# EAGLE design proj_pcb (EAGLE 7.5.0)
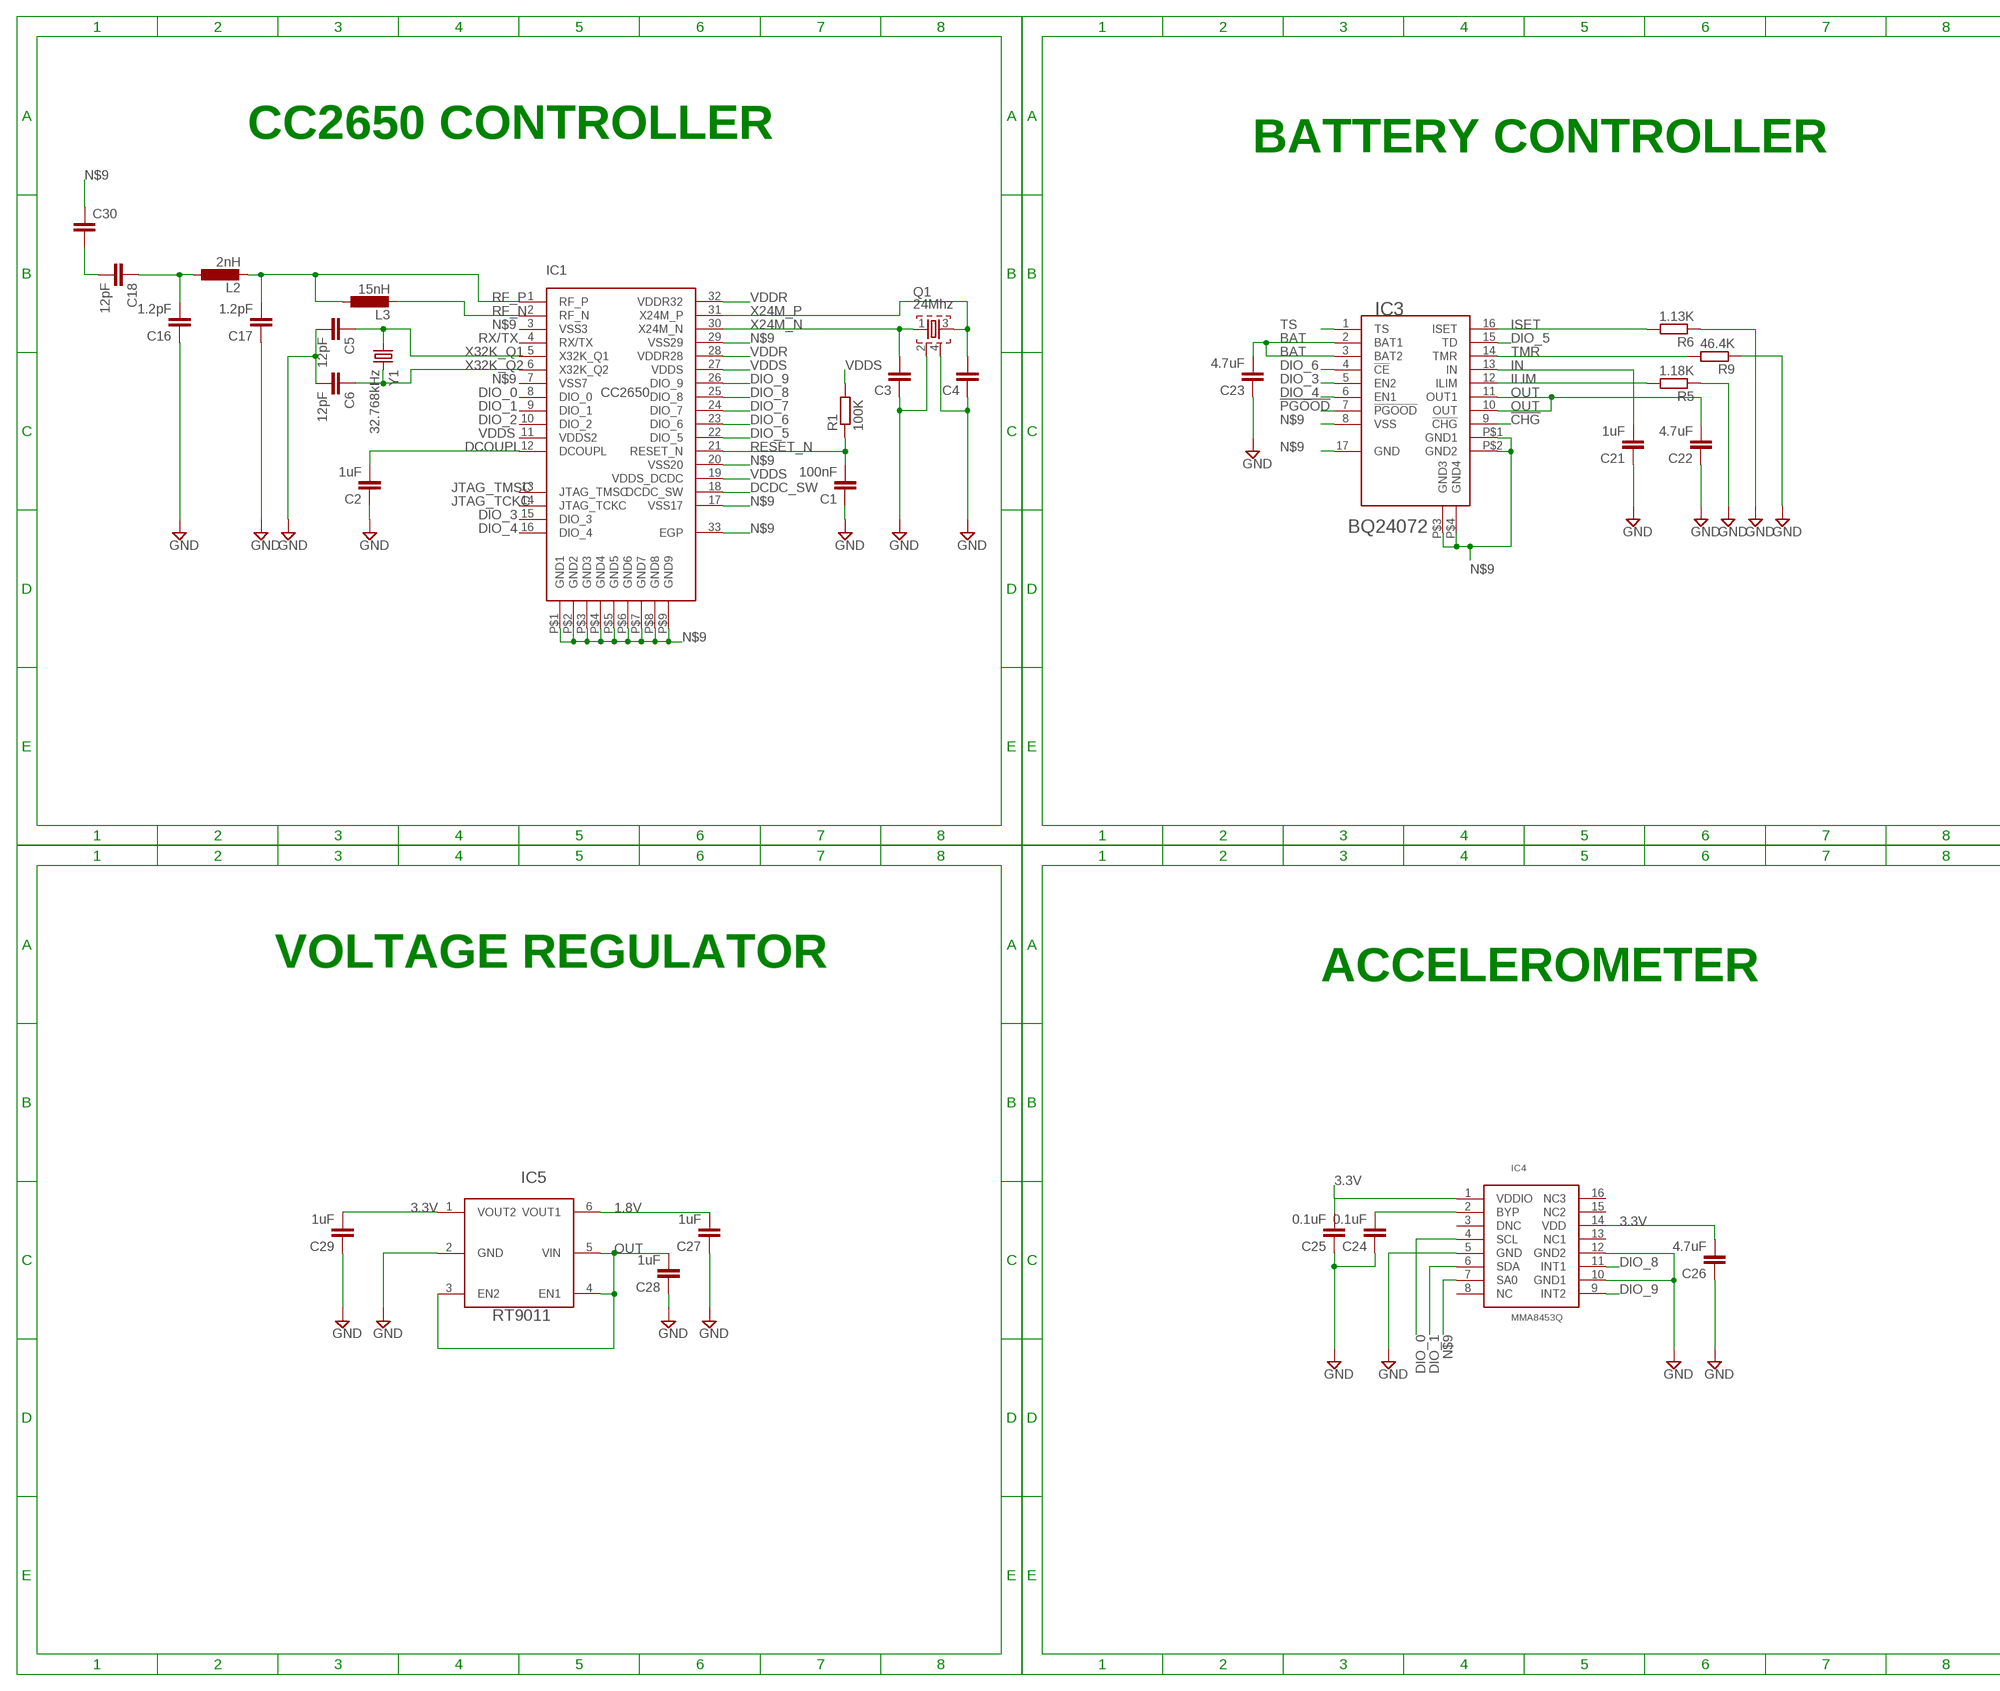
[diagram p0: schematic, sheet 1, part 1 of 2]
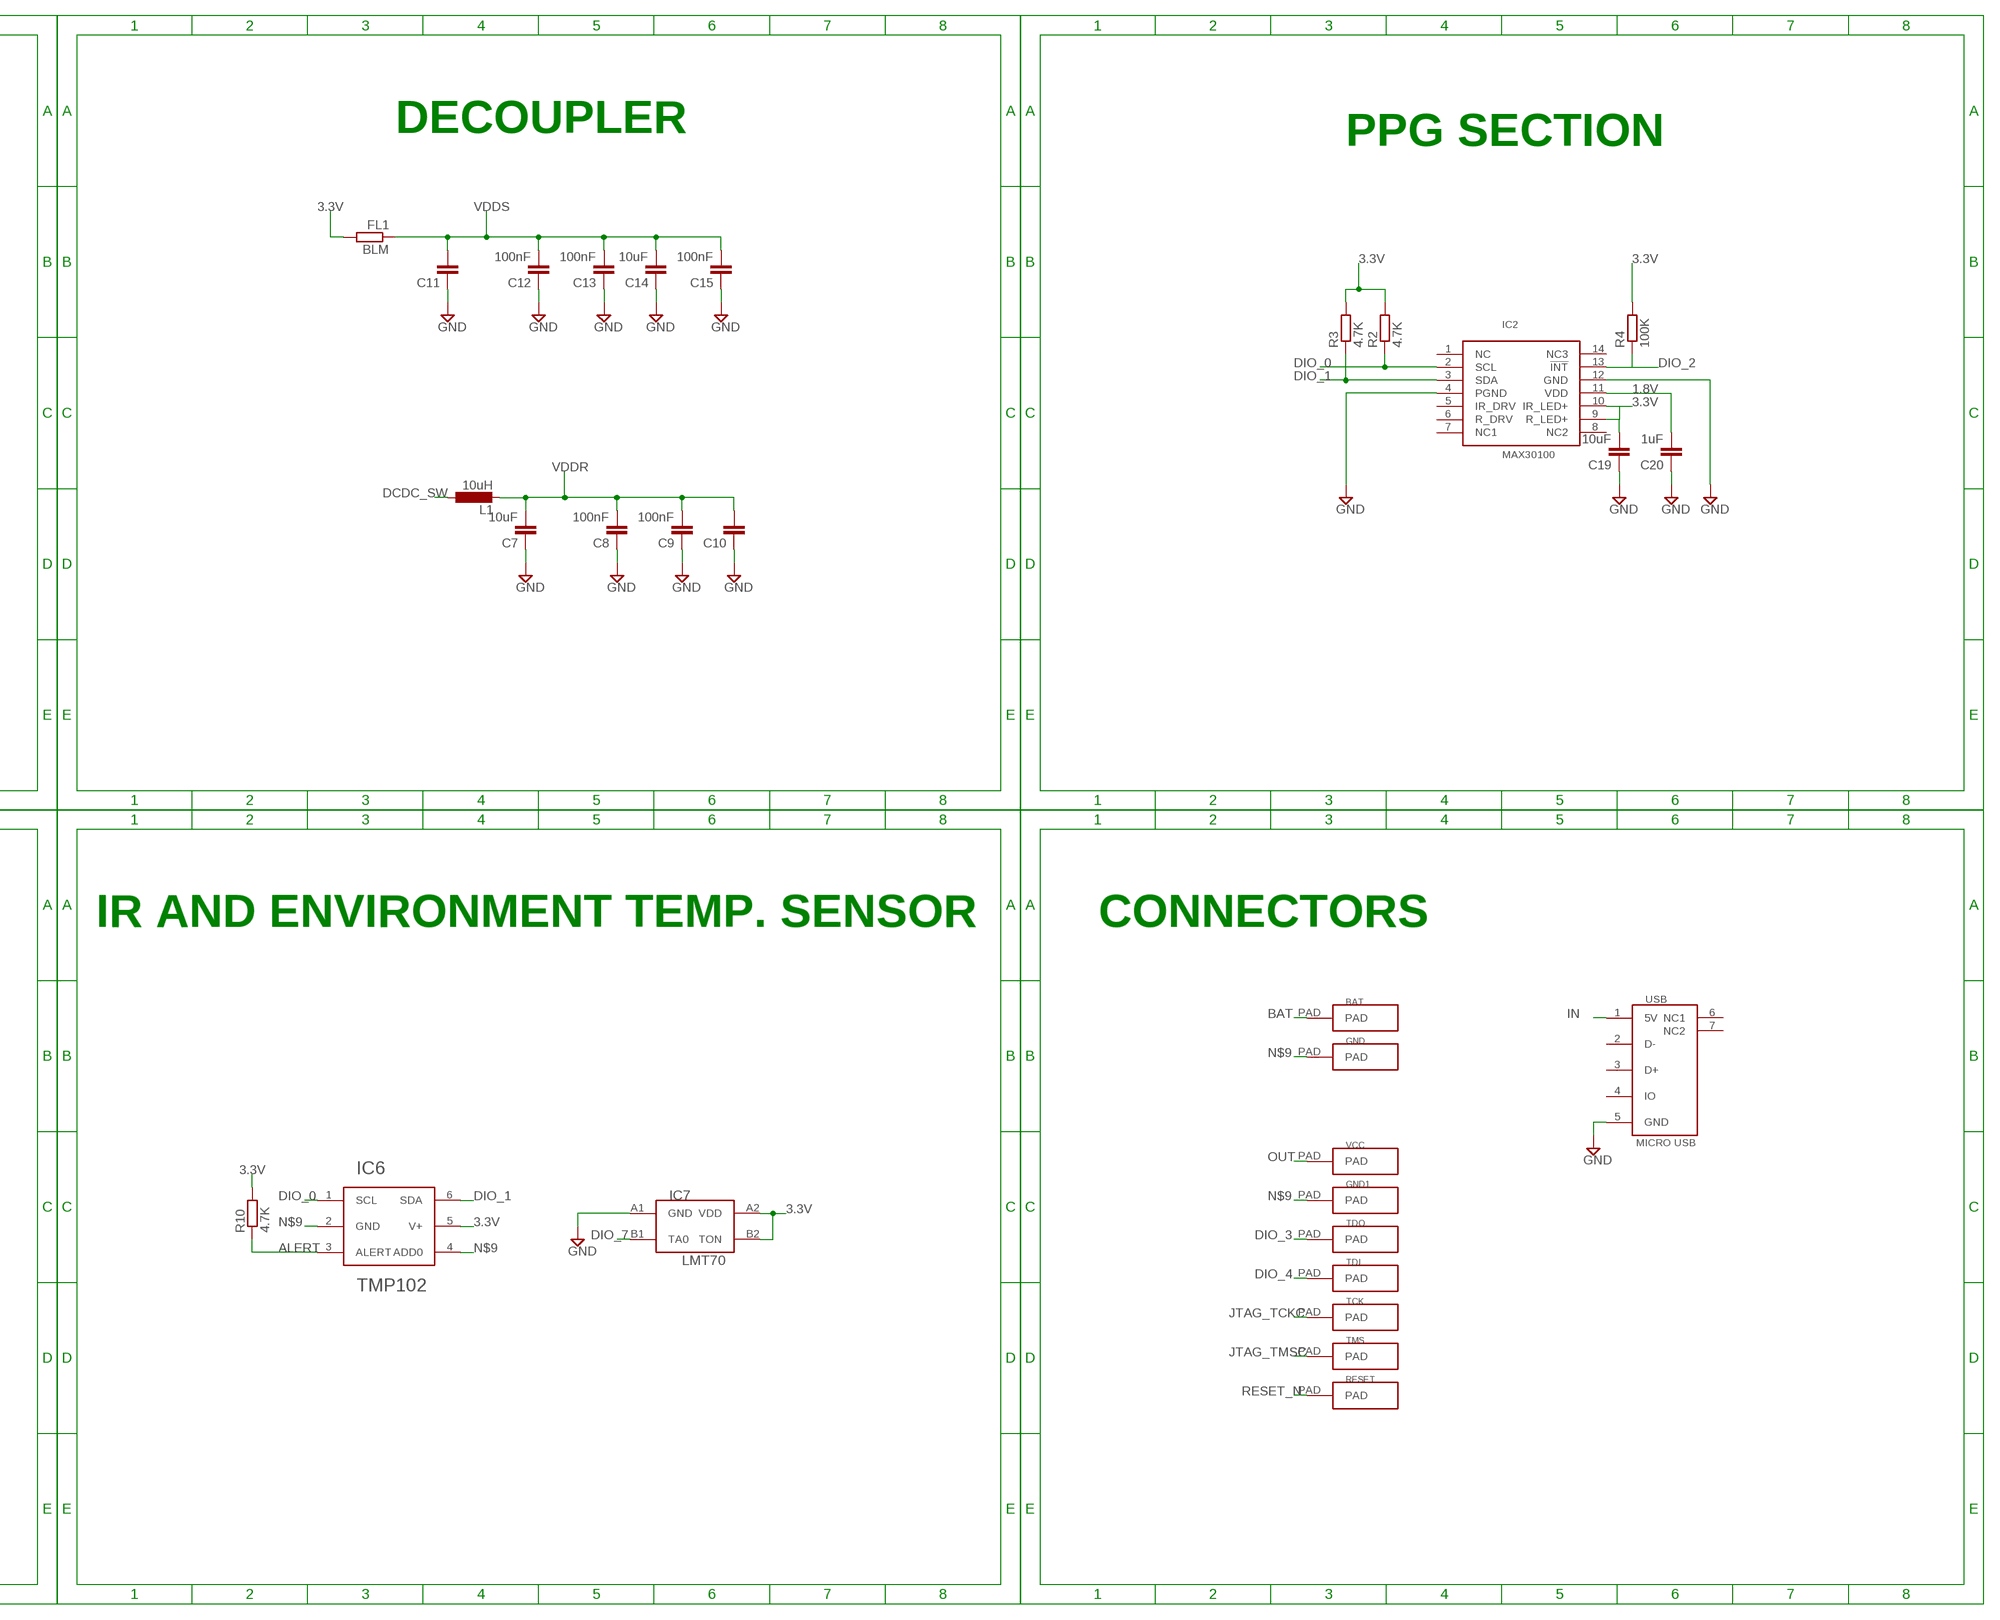
[diagram p1: schematic, sheet 1, part 2 of 2]

## Parts
BAT  SMD_PAD  [SMD_PAD]
BLM  FL1  R-EU_R0603  [R0603]
C1  100nF  C-EUC0603  [C0603]
C2  1uF  C-EUC0603  [C0603]
C3  C-EUC0603  [C0603]
C4  C-EUC0603  [C0603]
C5  12pF  C-EUC0603  [C0603]
C6  12pF  C-EUC0603  [C0603]
C7  10uF  C-EUC0603  [C0603]
C8  100nF  C-EUC0603  [C0603]
C9  100nF  C-EUC0603  [C0603]
C10  C-EUC0603  [C0603]
C11  C-EUC0603  [C0603]
C12  100nF  C-EUC0603  [C0603]
C13  100nF  C-EUC0603  [C0603]
C14  10uF  C-EUC0603  [C0603]
C15  100nF  C-EUC0603  [C0603]
C16  1.2pF  C-EUC0603  [C0603]
C17  1.2pF  C-EUC0603  [C0603]
C18  12pF  C-EUC0603  [C0603]
C19  10uF  C-EUC0603  [C0603]
C20  1uF  C-EUC0603  [C0603]
C21  1uF  C-EUC0603  [C0603]
C22  4.7uF  C-EUC0603  [C0603]
C23  4.7uF  C-EUC0603  [C0603]
C24  0.1uF  C-EUC0603  [C0603]
C25  0.1uF  C-EUC0603  [C0603]
C26  4.7uF  C-EUC0603  [C0603]
C27  1uF  C-EUC0603  [C0603]
C28  1uF  C-EUC0603  [C0603]
C29  1uF  C-EUC0603  [C0603]
C30  C-EUC1808  [C1808]
GND  SMD_PAD  [SMD_PAD]
GND1  SMD_PAD  [SMD_PAD]
IC1  CC2650_UC  [CC2650_UC]
IC2  MAX30100  [MAX30100]
IC3  BQ24072_BATTERY  [BQ24072_BATTERY]
IC4  MMA8453Q  [MMA8453Q]
IC5  RT9011  [RT9011]
IC6  TMP102  [TMP102]
IC7  LMT70  [LMT70]
L1  10uH  L-EUL2012C  [L2012C]
L2  2nH  L-EUL2012C  [L2012C]
L3  15nH  L-EUL2012C  [L2012C]
Q1  24Mhz  FA-128  [FA-128]
R1  100K  R-EU_R0603  [R0603]
R2  4.7K  R-EU_R0603  [R0603]
R3  4.7K  R-EU_R0603  [R0603]
R4  100K  R-EU_R0603  [R0603]
R5  1.18K  R-EU_R0603  [R0603]
R6  1.13K  R-EU_R0603  [R0603]
R9  46.4K  R-EU_R0603  [R0603]
R10  4.7K  R-EU_R0603  [R0603]
RESET  SMD_PAD  [SMD_PAD]
TCK  SMD_PAD  [SMD_PAD]
TDI  SMD_PAD  [SMD_PAD]
TDO  SMD_PAD  [SMD_PAD]
TMS  SMD_PAD  [SMD_PAD]
USB  MICRO_USB  [MICRO_USB]
VCC  SMD_PAD  [SMD_PAD]
Y1  32.768kHz  FC-12M  [FC-12M]

## Nets
1.8V: C20.2 C27.2 IC2.11(VDD) IC5.6(VOUT1)
3.3V: BLM.2 C19.2 C25.2 C26.2 C29.2 IC2.9(R_LED+) IC2.10(IR_LED+) IC4.1(VDDIO) IC4.14(VDD) IC5.1(VOUT2) IC6.5(V+) IC7.A2(VDD) IC7.B2(TON) R2.2 R3.2 R4.2 R10.2
!CHG: IC3.9(!CHG)
!PGOOD: IC3.7(!PGOOD)
ALERT: IC6.3(ALERT) R10.1
BAT: BAT.PAD C23.2 IC3.2(BAT1) IC3.3(BAT2)
DCDC_SW: IC1.18(DCDC_SW) L1.1
DCOUPL: C2.2 IC1.12(DCOUPL)
DIO_0: IC1.8(DIO_0) IC2.2(SCL) IC4.4(SCL) IC6.1(SCL) R2.1
DIO_1: IC1.9(DIO_1) IC2.3(SDA) IC4.6(SDA) IC6.6(SDA) R3.1
DIO_2: IC1.10(DIO_2) IC2.13(!INT) R4.1
DIO_3: IC1.15(DIO_3) IC3.5(EN2) TDO.PAD
DIO_4: IC1.16(DIO_4) IC3.6(EN1) TDI.PAD
DIO_5: IC1.22(DIO_5) IC3.15(TD)
DIO_6: IC1.23(DIO_6) IC3.4(!CE)
DIO_7: IC1.24(DIO_7) IC7.B1(TA0)
DIO_8: IC1.25(DIO_8) IC4.11(INT1)
DIO_9: IC1.26(DIO_9) IC4.9(INT2)
ILIM: IC3.12(ILIM) R5.2
IN: C21.2 IC3.13(IN) USB.1(5V)
ISET: IC3.16(ISET) R6.2
JTAG_TCKC: IC1.14(JTAG_TCKC) TCK.PAD
JTAG_TMSC: IC1.13(JTAG_TMSC) TMS.PAD
N$1: C16.2 C18.1 L2.1
N$2: C18.2 C30.2
N$5: C24.2 IC4.2(BYP)
N$9: C1.1 C2.1 C3.1 C4.1 C5.2 C6.2 C7.1 C8.1 C9.1 C10.1 C11.1 C12.1 C13.1 C14.1 C15.1 C16.1 C17.1 C19.1 C20.1 C21.1 C22.1 C23.1 C24.1 C25.1 C26.1 C27.1 C28.1 C29.1 C30.1 GND1.PAD GND.PAD IC1.3(VSS3) IC1.7(VSS7) IC1.17(VSS17) IC1.20(VSS20) IC1.29(VSS29) IC1.33(EGP) IC1.P$1(GND1) IC1.P$2(GND2) IC1.P$3(GND3) IC1.P$4(GND4) IC1.P$5(GND5) IC1.P$6(GND6) IC1.P$7(GND7) IC1.P$8(GND8) IC1.P$9(GND9) IC2.4(PGND) IC2.12(GND) IC3.8(VSS) IC3.17(GND) IC3.P$1(GND1) IC3.P$2(GND2) IC3.P$3(GND3) IC3.P$4(GND4) IC4.5(GND) IC4.7(SA0) IC4.10(GND1) IC4.12(GND2) IC5.2(GND) IC6.2(GND) IC6.4(ADD0) IC7.A1(GND) Q1.2 Q1.4 R5.1 R6.1 R9.1 USB.5(GND) ; supply symbol labelled GND
OUT: C22.2 C28.2 IC3.10(OUT) IC3.11(OUT1) IC5.3(EN2) IC5.4(EN1) IC5.5(VIN) VCC.PAD
RESET_N: C1.2 IC1.21(RESET_N) R1.1 RESET.PAD
RF_N: IC1.2(RF_N) L3.2
RF_P: C17.2 IC1.1(RF_P) L2.2 L3.1
RX/TX: IC1.4(RX/TX)
TMR: IC3.14(TMR) R9.2
TS: IC3.1(TS)
VDDR: C7.2 C8.2 C9.2 C10.2 IC1.28(VDDR28) IC1.32(VDDR32) L1.2
VDDS: BLM.1 C11.2 C12.2 C13.2 C14.2 C15.2 IC1.11(VDDS2) IC1.19(VDDS_DCDC) IC1.27(VDDS) R1.2
X24M_N: C3.2 IC1.30(X24M_N) Q1.1
X24M_P: C4.2 IC1.31(X24M_P) Q1.3
X32K_Q1: C5.1 IC1.5(X32K_Q1) Y1.1
X32K_Q2: C6.1 IC1.6(X32K_Q2) Y1.2
Unconnected: IC2.1(NC) IC2.5(IR_DRV) IC2.6(R_DRV) IC2.7(NC1) IC2.8(NC2) IC2.14(NC3) IC4.3(DNC) IC4.8(NC) IC4.13(NC1) IC4.15(NC2) IC4.16(NC3) USB.2(D-) USB.3(D+) USB.4(IO) USB.6(NC1) USB.7(NC2)

## Notes on the sheet
- CC2650 CONTROLLER | BATTERY CONTROLLER | DECOUPLER | PPG SECTION
- VOLTAGE REGULATOR | ACCELEROMETER | IR AND ENVIRONMENT TEMP. SENSOR | CONNECTORS

## Library data of the parts
BAT GND GND1 RESET TCK TDI TDO TMS VCC = smd_pad:SMD_PAD
BLM R1-R6 R9 R10 = resistor:R-EU_: RESISTOR, European symbol
C1-C30 = rcl:C-EU: CAPACITOR, European symbol
IC1 = cc2650_uc:CC2650_UC
IC2 = max30100:MAX30100
IC3 = bq24072_battery:BQ24072_BATTERY
IC4 = mma8453:MMA8453Q
IC5 = rt9011:RT9011
IC6 = tmp102:TMP102
IC7 = lmt70:LMT70
L1-L3 = rcl:L-EU: INDUCTOR, European symbol
Q1 = crystal:FA-: MHz RANGE CRYSTAL UNIT Source: Epson Toyocom
USB = micro_usb:MICRO_USB
Y1 = crystal:FC-12M: kHz RANGE CRYSTAL UNIT LOW PROFILE SMD Source: Epson Toyocom FC-12M.pdf

## Board
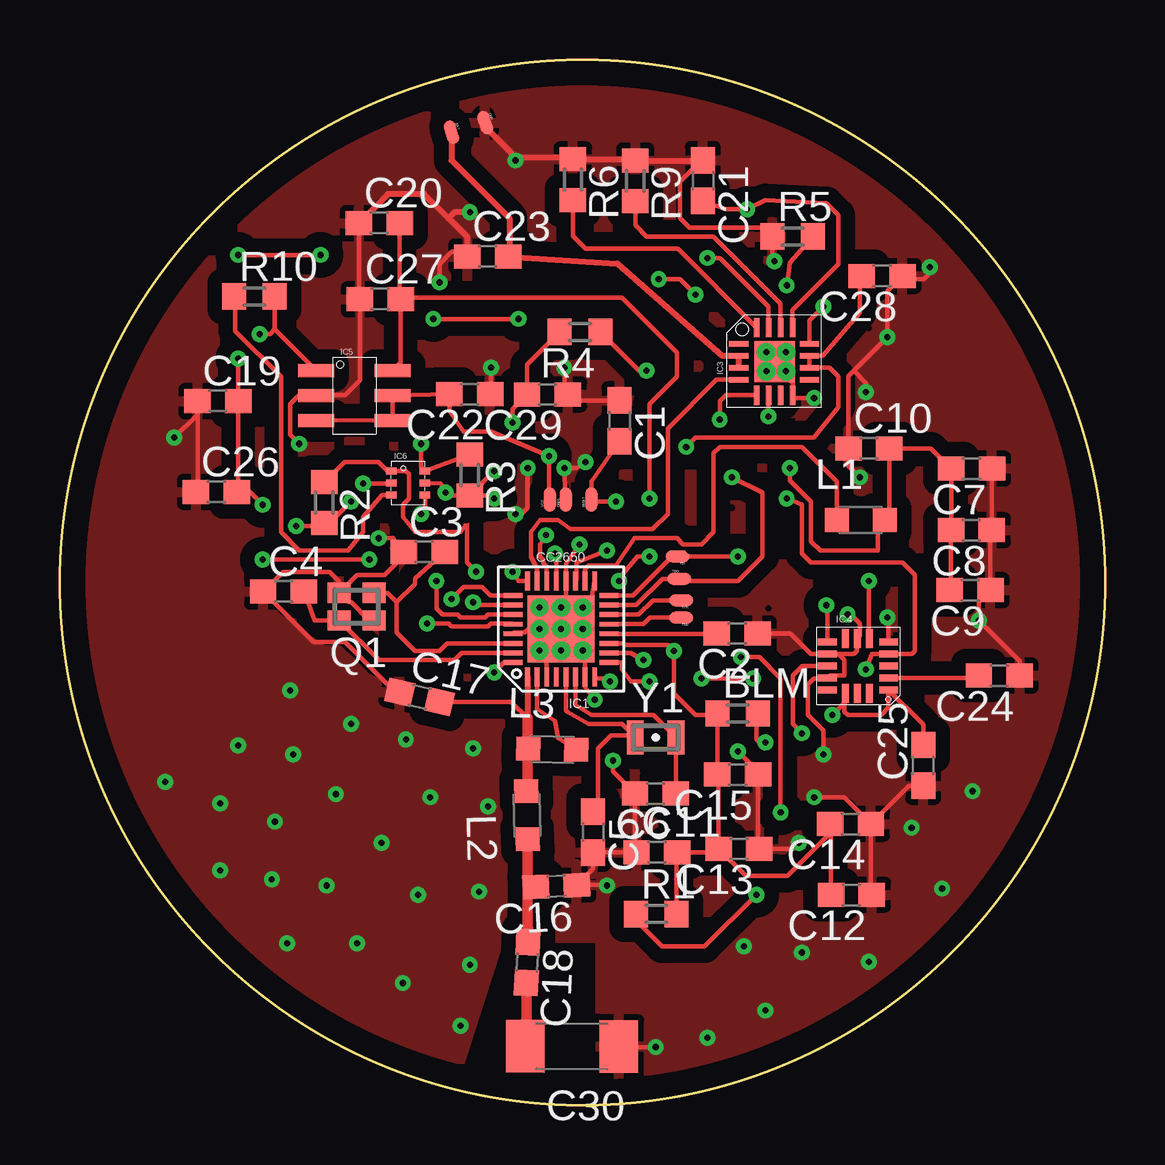
[diagram p2: board, top side]
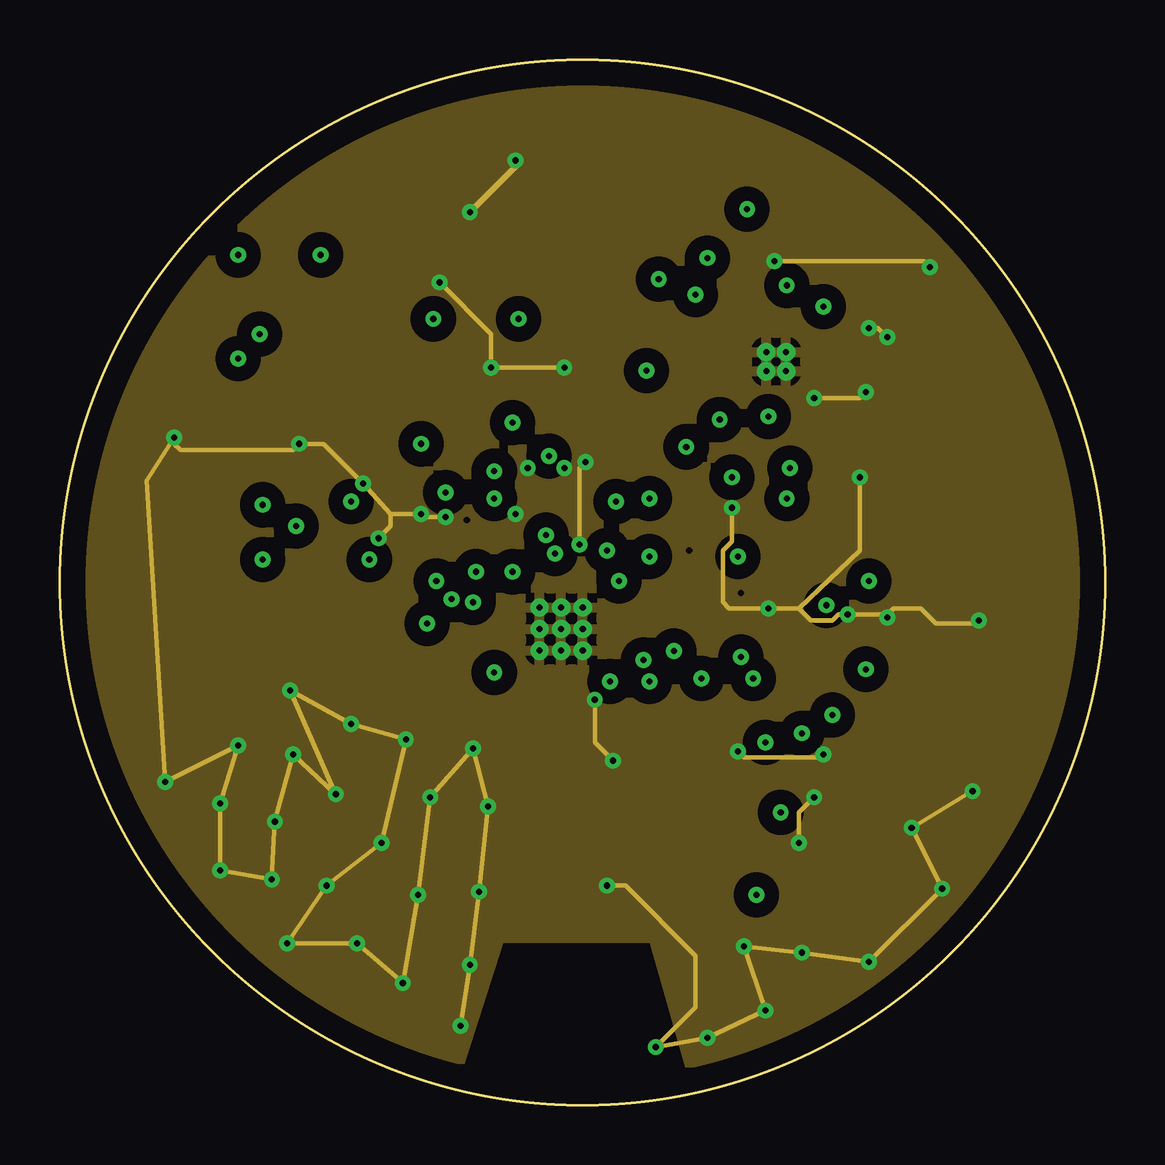
[diagram p3: board, inner layer GND]
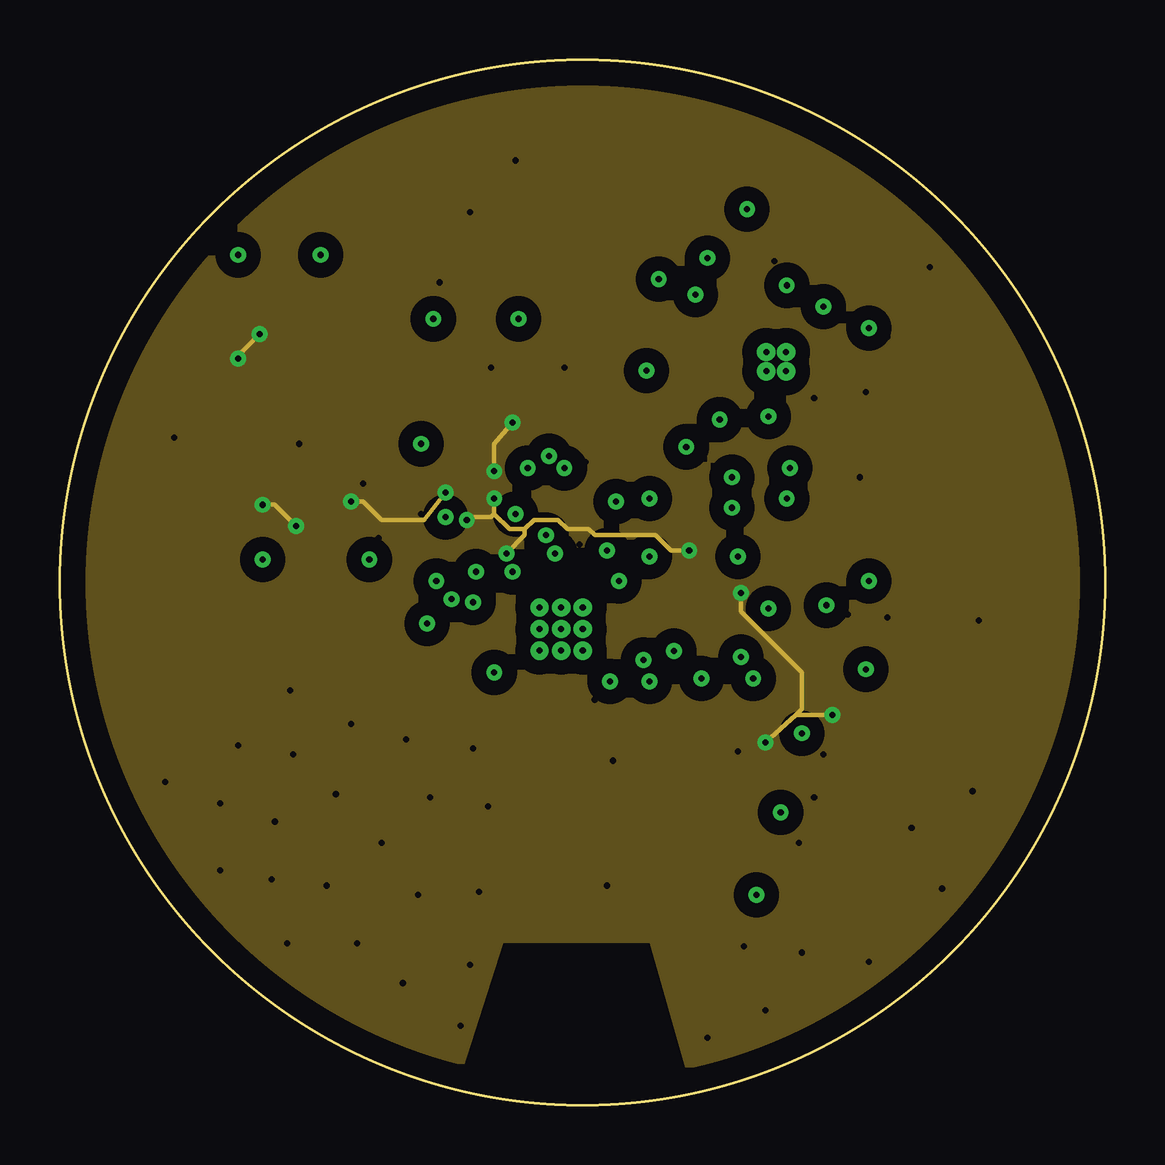
[diagram p4: board, inner layer 3.3V]
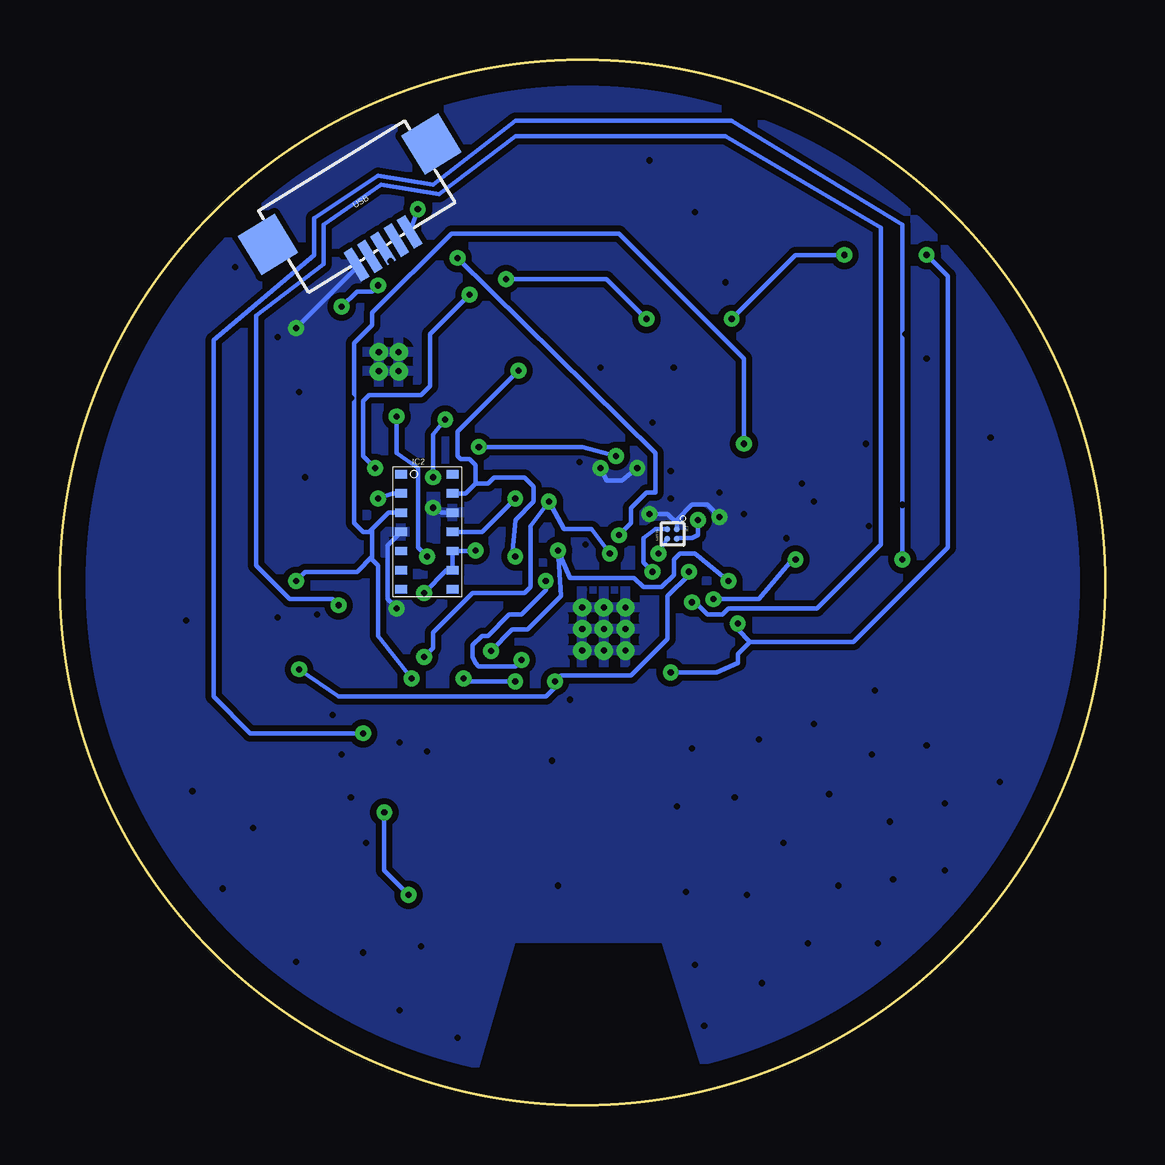
[diagram p5: board, bottom side, seen from below]

Size 43.56 x 43.56 mm. Coordinates in mm from the lower left corner, seen from the top.
Outline: circle at 21.78,21.78 radius 21.78
Copper layers [3:((1*2)+(3*16)):2]: Top 0.035mm / dielectric 10mil / GND 0.035mm / dielectric 40mil / 3.3V 0.035mm / dielectric 10mil / Bottom 0.035mm
Design rules "default *": minimum track width 7mil, minimum drill 10mil, track to track 5mil, track to pad 5mil, pad to pad 5mil, via to via 5mil, smd to smd 5mil, copper to edge 40mil, drill to drill 8mil, minimum pad ring 10mil, minimum via ring 8mil, stop-mask expansion 4mil, vias tented up to drill 0mil, thermal gap 10mil

### Footprints (pad centres in the part's own frame; a part is rotated, then mirrored left to right if it is on the bottom)
SMD_PAD = smd 1 x 0.5: PAD 0,0
R0603 = smd 1 x 1.1: 1 -0.85,0; 2 0.85,0
C0603 = smd 1.1 x 1: 1 -0.85,0; 2 0.85,0
C1808 = smd 1.6 x 2.2: 1 -1.95,0; 2 1.95,0
CC2650_UC = smd 0.2 x 0.8: 1 1.4,2; 2 1,2; 3 0.6,2; 4 0.2,2; 5 -0.2,2; 6 -0.6,2; 7 -1,2; 8 -1.4,2; 17 -1.4,-2; 18 -1,-2; 19 -0.6,-2; 20 -0.2,-2; 21 0.2,-2; 22 0.6,-2; 23 1,-2; 24 1.4,-2 | smd 0.8 x 0.2: 9 -2,1.4; 10 -2,1; 11 -2,0.6; 12 -2,0.2; 13 -2,-0.2; 14 -2,-0.6; 15 -2,-1; 16 -2,-1.4; 25 2,-1.4; 26 2,-1; 27 2,-0.6; 28 2,-0.2; 29 2,0.2; 30 2,0.6; 31 2,1; 32 2,1.4 | smd 2.8 x 2.8: 33 0,0 | drill 0.254 pad 0.61: P$1 -0.9,0.9; P$2 0,0.9; P$3 0.9,0.9; P$4 -0.9,0; P$5 0,0; P$6 0.9,0; P$7 -0.9,-0.9; P$8 0,-0.9; P$9 0.9,-0.9
MAX30100 = smd 0.5 x 0.35: 1 -1.15,2.3; 2 -1.15,1.5; 3 -1.15,0.7; 4 -1.15,-0.1; 5 -1.15,-0.9; 6 -1.15,-1.7; 7 -1.15,-2.5; 8 1,-2.5; 9 1,-1.7; 10 1,-0.9; 11 1,-0.1; 12 1,0.7; 13 1,1.5; 14 1,2.3
BQ24072_BATTERY = smd 0.23 x 0.8: 1 0.75,1.55; 2 0.25,1.55; 3 -0.25,1.55; 4 -0.75,1.55; 9 -0.75,-1.4; 10 -0.25,-1.4; 11 0.25,-1.4; 12 0.75,-1.4 | smd 0.8 x 0.23: 5 -1.4,0.8; 6 -1.4,0.3; 7 -1.4,-0.2; 8 -1.4,-0.7; 13 1.425,-0.7; 14 1.425,-0.2; 15 1.425,0.3; 16 1.425,0.8 | smd 1.7 x 1.7: 17 0,0.05 | drill 0.254 pad 0.508: P$1 -0.4,0.4; P$2 0.4,0.4; P$3 0.4,-0.427; P$4 -0.4,-0.427
MMA8453Q = smd 0.787 x 0.28: 1 1.3,-1; 2 1.3,-0.5; 3 1.3,0; 4 1.3,0.5; 5 1.3,1; 9 -1.25,1; 10 -1.25,0.5; 11 -1.25,0; 12 -1.25,-0.5; 13 -1.25,-1 | smd 0.28 x 0.787: 6 0.5,1.15; 7 0,1.15; 8 -0.5,1.15; 14 -0.5,-1.15; 15 0,-1.15; 16 0.5,-1.15
RT9011 = smd 1.5 x 0.559: 1 -1.6,1.041; 2 -1.6,0; 3 -1.6,-1.041; 4 1.6,-1.041; 5 1.6,0; 6 1.6,1.041
TMP102 = smd 0.45 x 0.3: 1 -0.7,0.55; 2 -0.7,0.05; 3 -0.7,-0.45; 4 0.7,-0.45; 5 0.7,0.05; 6 0.7,0.55
LMT70 = smd 0.25 x 0.25: A1 -0.2,0.2; A2 0.2,0.2; B1 -0.2,-0.2; B2 0.2,-0.2
L2012C = smd 1 x 1: 1 -1,0; 2 1,0
FA-128 = smd 0.95 x 0.85: 1 -0.725,-0.575; 2 0.725,-0.575; 3 0.725,0.575; 4 -0.725,0.575
MICRO_USB = smd 0.4 x 1.4: 1 -1.3,2.15; 2 -0.65,2.15; 3 0,2.15; 4 0.65,2.15; 5 1.3,2.15 | smd 1.8 x 1.9: 6 -4,-0.5; 7 4,-0.5
FC-12M = smd 0.7 x 1.4: 1 -0.85,0; 2 0.85,0

### Placement (x,y rotation side)
BAT  16.32,40.54 286.9 top
BLM  28.25,16.32 0 top
C1  23.32,28.52 270 top
C2  28.23,19.66 180 top
C3  15.19,23.05 0 top
C4  9.32,21.4 0 top
C5  22.21,11.38 270 top
C6  24.82,12.98 180 top
C7  38,26.52 180 top
C8  37.99,23.96 180 top
C9  37.94,21.46 180 top
C10  33.72,27.37 0 top
C11  24.88,10.53 0 top
C12  32.99,8.76 180 top
C13  28.3,10.68 180 top
C14  32.95,11.72 180 top
C15  28.25,13.78 180 top
C16  20.69,9.13 182.6 top
C17  14.99,17.01 346.5 top
C18  19.47,5.94 267.6 top
C19  6.58,29.34 0 top
C20  13.31,36.76 0 top
C21  26.8,38.53 270 top
C22  17.08,29.63 180 top
C23  17.83,35.37 0 top
C24  39.15,17.9 180 top
C25  35.98,14.16 90 top
C26  6.52,25.55 0 top
C27  13.35,33.59 0 top
C28  34.27,34.56 180 top
C29  20.32,29.62 180 top
C30  21.34,2.45 179.8 top
GND  17.72,40.94 289.4 top
GND1  21.09,25.24 90 top
IC1  20.89,19.84 180 top
IC2  28.2,23.99 0 bottom
IC3  29.84,30.98 90 top
IC4  33.24,18.3 0 top
IC5  12.27,29.57 0 top
IC6  14.51,25.88 0 top
IC7  18.05,23.8 270 bottom
L1  33.38,24.39 0 top
L2  19.46,12.08 91.5 top
L3  20.53,14.83 358.6 top
Q1  12.37,20.77 180 top
R1  24.85,7.96 0 top
R2  11.02,25.11 270 top
R3  17.08,26.26 270 top
R4  21.68,32.22 180 top
R5  30.54,36.2 0 top
R6  21.38,38.57 270 top
R9  23.98,38.52 270 top
R10  8.1,33.7 0 top
RESET  22.15,25.24 90 top
TCK  25.89,21.04 180 top
TDI  25.76,22.86 180 top
TDO  25.81,21.93 0 top
TMS  25.89,20.31 180 top
USB  31.22,37.54 211.6 bottom
VCC  20.42,25.24 90 top
Y1  24.83,15.32 0 top

### Tracks (layer width: path | path; a pad name or v marks a point on that pad's centre or on a via)
1.8V  (via drill 0.25 pad 0.25)
  Top 0.178: C20.2 14.16,33.63 C27.2 | C27.2 14.2,30.94 IC5.6 | v24.58,25.27 24.58,29.21 25.72,30.35 25.72,31.37 23.44,33.66 14.27,33.66 C27.2
  Bottom 0.178: IC2.11 25.96,23.89 v24.58,25.27
3.3V  (via drill 0.25 pad 0.25 layers 1-3, 0.25 pad 0.25 layers 3-16)
  Top 0.178: R10.2 8.95,32.33 | 8.95,32.33 IC5.1 | 7.43,25.61 C19.2 v7.43,31.11 v7.43,31.12 | 7.43,25.61 C26.2 | 7.43,25.61 7.86,25.61 v8.45,25.02 | v9.85,24.13 10.89,24.13 R2.2 11.25,24.26 v12.13,25.15 | IC6.5 15.86,25.91 15.94,25.78 v16.07,25.53 16.21,25.41 R3.2 | R3.2 17.09,25.41 v18.1,26.42 | v18.86,28.45 18.86,29.01 C29.2 19.47,30.86 R4.2 | R3.2 17.97,25.41 v18.1,25.27 | C25.2 35.98,15.86 IC4.1 34.54,16.57 34.23,16.26 32.83,16.26 32.71,16.38 32.71,17.12 IC4.14 32.74,16.8 v32.2,16.26 | v29.41,15.11 29.15,15.11 29.02,15.24 29.02,16.24 BLM.2 | v8.32,32.13 8.75,32.13 8.95,32.33
  3.3V 0.178: v8.45,25.02 8.96,25.02 v9.85,24.13 | v12.13,25.15 12.64,25.15 13.4,24.39 15.18,24.39 v16.07,25.53 | v18.1,26.42 18.1,27.56 v18.86,28.45 | v18.1,25.27 18.1,24.64 | 18.1,24.64 17.98,24.51 17.09,24.51 v16.96,24.39 | v32.2,16.26 30.68,16.26 | 30.68,16.26 v29.41,15.11 | 18.61,23.12 v18.61,22.99 19.37,23.75 19.37,24 | v28.39,21.34 28.39,20.58 30.93,18.04 30.93,16.51 30.68,16.26 | v26.23,23.12 25.47,23.12 24.83,23.75 22.29,23.75 22.04,24 21.15,24 20.77,24.39 19.75,24.39 19.37,24 | v7.43,31.12 7.43,31.24 v8.32,32.13 | 19.37,24 18.74,24 18.1,24.64
  Bottom 0.178: v16.96,24.39 16.96,23.75 17.21,23.62 17.82,23.62 IC7.A2 | v26.23,23.12 26.26,23.09 IC2.10 IC2.9 27.44,22.29 v28.39,21.34 | v18.61,22.99 18.48,23.23 IC7.B2
  pour 3.3V (isolate 0.61): 26.02,42.34 28.04,41.54 arc-355 26.14,42.04
ALERT
  Top 0.178: IC6.3 13.43,25.43 12.64,24.51 12.64,23.88 12.01,23.12 9.97,23.12 9.21,23.88 9.21,30.35 7.31,32.26 7.31,33.64 R10.1
BAT
  Top 0.254: IC3.3 IC3.2 27.6,31.24 23.23,35.08 C23.2 18.74,35.43 18.74,36.96 16.32,39.38 BAT.PAD
DCDC_SW
  Top 0.178: IC1.18 21.89,22.33 22.04,22.48 23.18,22.48 23.94,23.62 25.72,23.62 25.98,23.37 26.74,23.37 27.25,23.88 27.25,27.18 27.5,27.43 30.93,27.43 32.38,25.98 L1.1
DCOUPL
  Top 0.178: IC1.12 27.36,19.64 C2.2
DIO_0  (via drill 0.25 pad 0.25)
  Top 0.178: v30.29,25.27 30.93,25.02 30.93,22.99 31.31,22.61 35.12,22.61 35.63,22.1 35.63,18.92 35.5,18.8 IC4.4 33.85,18.8 v33.6,18.16 | v17.34,22.23 16.96,22.61 16.96,24.26 16.71,23.88 14.8,23.88 14.29,24.51 14.29,25.02 14.55,25.27 14.55,26.29 14.41,26.43 IC6.1 13.65,26.43 13.28,26.8 11.86,26.8 R2.1 | v22.93,17.65 22.8,17.78 22.35,17.78 IC1.8
  Bottom 0.178: IC2.2 29.7,25.49 v30.29,25.27 | v17.34,22.23 17.34,22.1 18.23,21.21 18.23,19.43 19.75,17.91 22.67,17.91 v22.93,17.65 22.93,17.4 23.31,17.02 31.95,17.02 v33.6,18.16
DIO_1  (via drill 0.25 pad 0.25)
  Top 0.178: R3.1 IC6.6 15.05,26.58 v15.05,27.56 | v33.72,21.85 33.72,19.47 IC4.6 | v28.9,17.78 v26.74,17.78 | v24.58,17.65 23.8,17.65 23.44,18.15 23.44,18.42 23.41,18.44 IC1.9
  Bottom 0.178: 30.55,24 29.86,24.69 IC2.3 | 30.55,24 30.55,22.86 | 30.55,22.86 31.18,22.23 33.34,22.23 v33.72,21.85 | 30.55,24 30.68,23.88 30.93,23.88 31.31,24.26 31.31,31.75 30.55,32.51 30.55,33.02 27.25,36.32 20.26,36.32 15.05,31.12 v15.05,27.56 | 30.55,22.86 30.55,22.73 30.29,22.48 30.29,19.56 v28.9,17.78 | v24.58,17.65 26.48,17.65 v26.74,17.78
DIO_2  (via drill 0.25 pad 0.25)
  Top 0.178: v24.45,30.61 24.14,30.61 R4.1 | IC1.10 23.77,18.84 v24.33,18.54 | v23.31,21.85 23.44,22.1 24.07,22.86 v24.58,22.86
  Bottom 0.178: IC2.13 26.65,25.49 26.23,25.91 | 26.23,25.91 26.23,26.67 26.48,26.93 26.87,26.93 26.99,27.05 26.99,28.07 v24.45,30.61 | v24.33,18.54 24.58,18.29 26.1,18.29 26.23,18.42 26.36,18.67 26.36,19.18 25.98,19.56 25.72,19.56 24.83,20.45 24.33,20.45 23.31,21.46 v23.31,21.85 | 26.23,25.91 25.72,25.91 25.47,26.16 24.2,26.16 23.82,25.78 23.82,25.15 24.58,24.39 24.71,22.86 v24.58,22.86
DIO_3  (via drill 0.25 pad 0.25)
  Top 0.178: IC1.15 24.02,20.84 25.11,21.93 TDO.PAD 25.81,21.88 25.85,21.85 28.26,21.85 29.28,22.86 29.28,25.53 v28.01,26.16 | v27.5,28.58 27.5,29.34 27.75,29.59 29.03,29.59 IC3.5
  Bottom 0.178: v28.01,26.16 28.01,27.94 v27.5,28.58
DIO_4  (via drill 0.25 pad 0.25)
  Top 0.178: IC1.16 23.89,21.24 25.52,22.86 TDI.PAD v28.26,22.86 | IC3.6 29.54,28.71 v29.53,28.7
  Bottom 0.178: v29.53,28.7 29.53,27.18 28.64,26.54 28.64,23.24 v28.26,22.86
DIO_5  (via drill 0.25 pad 0.25)
  Top 0.178: v26.99,35.31 27.5,35.31 29.53,33.28 IC3.15 | IC1.22 20.29,22.45 20.13,22.61 20.13,22.73 20.01,22.86 20.01,23.37 v20.26,23.75
  Bottom 0.178: v26.99,35.31 18.74,27.18 18.74,25.53 19.12,25.53 19.75,24.89 19.75,24.26 v20.26,23.75
DIO_6
  Top 0.178: IC1.23 19.89,22.34 19.63,22.86 19.63,23.88 20.01,24.39 20.77,24.39 21.28,24 24.71,24 25.34,24.64 25.34,28.2 27.37,30.23 IC3.4
DIO_7  (via drill 0.25 pad 0.25)
  Top 0.178: IC1.24 19.12,21.84 v18.86,22.23
  Bottom 0.178: v18.86,22.23 19.25,22.61 19.25,23.62 18.74,24 IC7.B1
DIO_8  (via drill 0.25 pad 0.25)
  Top 0.178: IC1.25 17.95,21.24 17.59,21.59 16.83,21.59 v16.32,21.08 | IC4.11 30.94,18.3 30.55,17.91 30.55,15.88 v30.93,15.5 | v8.45,22.73 v12.9,22.73
  Bottom 0.178: v16.32,21.08 14.42,21.08 13.02,22.73 v12.9,22.73 | v30.93,15.5 35.63,15.5 37.15,17.02 37.15,31.88 32.96,35.43 32.96,36.96 30.29,38.74 28.01,38.36 24.58,41.02 15.56,41.02 8.45,36.7 v8.45,22.73
DIO_9  (via drill 0.25 pad 0.25)
  Top 0.178: IC1.26 17.33,20.84 v17.21,20.96 | IC4.9 31.99,20.78 v31.95,20.83
  Bottom 0.178: v17.21,20.96 17.09,20.96 16.58,20.45 15.94,20.45 15.69,20.7 12.01,20.7 9.34,23.37 9.34,36.58 15.82,40.39 24.58,40.39 27.75,37.97 30.17,38.36 32.58,36.7 32.58,35.05 35.37,32.89 35.37,22.48 33.98,21.08 32.2,21.08 v31.95,20.83
ILIM  (via drill 0.25 pad 0.25)
  Top 0.178: IC3.12 31.24,32.7 v31.82,33.28 | v30.29,34.16 30.42,35.1 R5.2
  Bottom 0.178: v31.82,33.28 31.18,33.91 30.55,33.91 v30.29,34.16
IN  (via drill 0.25 pad 0.25)
  Top 0.178: 26.89,37.59 C21.2 27.75,37.34 v28.64,37.34 29.41,37.72 31.95,37.59 32.45,37.09 32.45,35.05 30.54,33.14 IC3.13
  Bottom 0.178: USB.1 28.61,37.38 v28.64,37.34
ISET
  Top 0.178: R6.2 21.38,36.22 21.91,35.69 25.76,35.69 IC3.16
JTAG_TCKC
  Top 0.178: TCK.PAD 24.72,21.04 24.12,20.44 IC1.14
JTAG_TMSC
  Top 0.178: TMS.PAD 24.59,20.31 24.32,20.04 IC1.13
N$1
  Top 0.178: 19.49,9.43 C16.2
  Top 0.445: L2.1 19.49,9.43 19.49,8.08 C18.1
N$2
  Top 0.178: 19.44,2.5 C30.2
  Top 0.445: C18.2 19.44,2.5
N$3
  cutout Top: 16.83,1.53 18.48,6.73 22.29,6.73 22.29,0.89 18.74,0.89
N$4
  cutout GND: 16.83,1.53 18.48,6.73 24.58,6.73 26.1,1.4 22.42,0.89 18.86,0.89
N$5
  Top 0.178: IC4.2 38.2,17.8 C24.2
N$7
  cutout 3.3V: 16.83,1.53 18.48,6.73 24.58,6.73 26.1,1.4 22.42,0.89 18.86,0.89
N$8
  cutout Bottom: 16.83,1.53 18.48,6.73 24.58,6.73 26.1,1.4 22.42,0.89 18.99,0.89
N$9  (via drill 0.25 pad 0.25, 0.25 pad 0.25 layers 1-2, 0.25 pad 0.25 layers 2-16)
  Top 0.178: 34.48,19.3 IC4.5 34.54,20.27 v34.48,20.32 | IC1.P$5 20.01,19.84 | IC1.P$6 19.53,19.84 19.37,19.69 18.94,19.69 IC1.29 | IC3.17 29.79,30.86 30.17,30.48 30.55,30.1 30.55,29.59 | 30.55,29.59 IC3.8 | 21.09,20.96 IC1.20 21.09,22.55 v21.66,23.37 | 21.09,20.96 21.09,20.7 21.09,20.04 IC1.P$5 | v9.97,27.56 9.59,27.94 9.59,29.21 9.95,29.57 IC5.2 10.69,29.59 11.88,29.59 12.5,30.21 C27.1 12.46,33.63 C20.1 | v12.64,25.91 13.79,25.91 IC6.2 | Q1.4 12.89,20.2 12.13,20.96 12.03,20.96 Q1.2 | Q1.2 11.64,21.83 11.24,22.23 9.3,22.23 C4.1 10.57,19.3 11.88,19.3 13.98,17.21 C17.1 | Q1.2 12.4,22.1 13.53,22.1 14.34,22.9 C3.1 13.89,23.62 v13.28,23.62 | v30.8,10.92 30.56,10.68 C13.1 29.1,10.73 C15.1 29.1,13.9 v28.26,14.73 | v31.44,12.83 32.69,12.83 C14.1 | C25.1 35.39,13.31 C14.1 | C14.1 33.8,8.8 C12.1 | C24.1 40,18.49 v38.3,20.19 38.3,20.96 C9.1 38.79,23.91 C8.1 C7.1 | C21.1 26.75,39.38 25.85,38.48 25.85,36.96 26.23,36.58 29.31,36.58 R5.1 29.69,35.28 v29.79,35.18 | v36.26,34.93 36.26,34.67 36.01,34.42 35.26,34.42 C28.1 34.48,33.92 v34.48,32.01 33.09,30.61 | 33.09,30.61 32.87,30.39 C10.1 32.87,26.64 v33.34,26.16 | 30.55,29.59 30.55,29.47 v31.44,29.47 | v33.6,29.72 33.6,30.1 33.09,30.61 | C26.1 5.73,25.61 C19.1 5.73,28.78 v4.77,27.81 | C1.1 21.42,29.37 C29.1 21.05,29.62 21.02,29.59 v21.02,30.73 | v17.98,30.73 17.98,29.68 C22.1 | IC6.4 15.21,24.92 v15.05,24.64 | C2.1 30.45,19.66 31.31,18.8 IC4.10 | IC4.10 32.96,18.8 33.09,18.8 33.22,18.92 33.22,19.43 IC4.7 33.34,19.55 33.34,20.07 32.96,20.45 v32.83,20.45 | IC4.10 32.45,18.8 32.71,18.54 32.71,17.91 32.1,17.91 IC4.12 31.97,17.78 31.44,17.78 31.18,17.53 31.18,16.26 31.82,15.62 v31.82,14.61
  Top 0.178: v15.82,34.29 15.82,35.05 16.32,35.56 16.79,35.56 C23.1 | v18.99,24.64 19.12,24.51 19.5,24.89 v19.5,26.54 | GND1.PAD 21.06,25.4 v21.02,26.54 21.53,26.54 v21.91,26.8 | IC1.17 22.16,21.08 22.04,21.08 21.22,21.08 21.09,20.96 | IC1.3 20.29,18.92 20.29,19.24 IC1.P$5 | IC1.P$1 21.89,18.84 IC1.7 21.89,17.42 v22.29,16.89 | IC1.P$1 IC1.P$5 | v23.06,14.35 23.06,13.9 C6.2 23.97,10.59 C11.1 C5.2 22.21,9.84 C16.1 22.78,9.17 v22.8,9.15 | 18.99,39.5 v18.99,39.37 | v24.83,2.41 23.32,2.41 C30.1
  Top 0.254: GND.PAD 17.72,40.77 18.99,39.5 21.3,39.5 R6.1 23.93,39.42 R9.1 C21.1 | C23.1 16.98,36.17 16.2,36.96 | 16.2,36.96 15.18,37.97 13.67,37.97 C20.1 | v17.09,37.21 16.45,37.21 16.2,36.96
  Top 0.406: IC1.P$9 IC1.P$8 | IC1.P$8 IC1.P$7 | IC1.P$8 21.05,20.74 21.09,20.7 | IC1.P$4 IC1.P$5 | IC1.P$6 20.01,19.84 | 20.29,18.92 20.27,18.94 IC1.P$3 IC1.P$2 | IC1.P$1 | IC3.P$2 29.44,31.34 IC3.17 | IC3.P$3 30.19,31.39 IC3.17 | IC3.P$1 29.44,30.64 IC3.17 | IC3.P$4 30.17,30.48
  GND 0.178: v38.04,13.08 v35.5,11.56 v36.77,9.02 v33.72,5.97 v30.93,6.35 v28.52,6.61 v29.41,3.94 v26.99,2.8 v24.83,2.41 26.48,4.07 26.48,6.22 23.56,9.15 v22.8,9.15 | v16.71,3.3 v17.09,5.84 v17.47,8.89 v17.85,12.45 v17.21,14.86 v15.44,12.83 v14.93,8.76 v14.29,5.08 v12.39,6.73 v9.47,6.73 v11.12,9.15 v13.4,10.92 v14.42,15.24 v12.13,15.88 v9.59,17.27 v11.5,12.96 v9.72,14.61 v8.96,11.81 v8.83,9.4 v6.67,9.78 v6.67,12.57 v7.43,14.99 v4.39,13.46 3.62,26.04 v4.77,27.81 4.77,27.56 5.02,27.31 9.72,27.31 v9.97,27.56 10.99,27.56 v12.64,25.91 13.78,24.64 | v38.3,20.19 38.17,20.07 36.52,20.07 35.88,20.7 34.74,20.7 34.48,20.45 v34.48,20.32 34.36,20.45 v32.83,20.45 32.45,20.45 32.2,20.19 31.31,20.19 30.8,20.7 | v30.8,10.92 30.8,12.19 v31.44,12.83 | v29.79,35.18 36.01,35.18 v36.26,34.93 | v33.72,32.39 34.1,32.39 v34.48,32.01 | v31.44,29.47 33.34,29.47 v33.6,29.72 | v21.02,30.73 v17.98,30.73 17.98,32.13 v15.82,34.29 | 13.78,24.64 v15.05,24.64 15.18,24.51 v16.07,24.51 | 13.78,24.64 13.78,24.13 v13.28,23.62 | v33.34,26.16 33.34,23.12 30.8,20.7 | 30.8,20.7 v29.53,20.7 27.88,20.7 27.63,20.96 27.63,23.12 28.01,23.5 v28.01,24.89 | v21.66,23.37 21.66,26.54 v21.91,26.8 | v22.29,16.89 22.29,15.11 v23.06,14.35 | v28.26,14.73 28.52,14.48 31.69,14.48 v31.82,14.61
  GND 0.254: v18.99,39.37 18.99,39.12 v17.09,37.21
  Bottom 0.178: USB.5 31.2,34.91 v33.72,32.39 | v29.53,20.7 29.91,21.08 29.91,23.33 IC2.4 | IC7.A1 17.85,24.39 | 17.85,24.39 17.21,25.02 16.58,25.02 v16.07,24.51 | 17.85,24.39 17.85,24.26 18.23,24.64 v18.99,24.64 | v21.02,26.54 20.77,26.04 20.13,26.04 v19.5,26.54 | IC2.12 27.68,24.69 v28.01,24.89
  pour Bottom (isolate 0.254): 26.22,42.34 28.02,41.54 arc-355 26.12,42.04
  pour Top (isolate 0.61): 26.22,42.34 28.02,41.54 arc-355 26.12,42.04
  pour GND (isolate 0.61): 26.22,42.34 28,41.54 arc-355 26.1,42.04
OUT  (via drill 0.25 pad 0.25)
  Top 0.178: IC5.3 10.94,28.55 IC5.4 IC5.5 C22.2 16.23,28.92 16.83,28.07 17.98,28.07 v20.39,27.05 20.39,25.14 VCC.PAD | C28.2 33.34,34.48 33.34,33.02 31.81,31.23 IC3.11 IC3.10 32.07,30.73 32.45,30.35 32.45,29.08 31.44,27.81 26.48,27.81 v26.1,27.43
  Bottom 0.178: v26.1,27.43 21.79,27.43 v20.39,27.05
RESET_N  (via drill 0.25 pad 0.25)
  Top 0.178: C1.2 22.15,25.99 RESET.PAD 22.18,25.15 v23.18,25.15 | IC1.21 20.69,22.53 v20.64,22.99 | R1.1 24,7.69 25.09,6.61 26.87,6.61 v29.02,8.76 | v28.39,18.67 29.15,18.67 30.04,17.78 v30.04,12.19
  Bottom 0.178: v28.39,18.67 28.01,19.05 28.01,19.69 26.36,21.34 24.2,21.34 23.94,21.59 23.94,24.13 v23.18,25.15 22.55,24 21.4,24 v20.64,22.99 | v30.04,12.19 30.04,9.78 v29.02,8.76
RF_N
  Top 0.178: IC1.2 19.89,16.5 20.64,16 20.77,15.31 L3.2
RF_P
  Top 0.178: 19.49,14.89 L3.1 | 19.49,13.13 L2.2 | C17.2 18.81,16.81 19.49,16.13
  Top 0.254: IC1.1 19.49,16.13
  Top 0.445: 19.49,16.13 19.49,15.75 19.49,14.89 19.49,13.13
TMR
  Top 0.178: R9.2 23.98,36.67 24.45,36.2 27.25,36.2 30.04,33.4 IC3.14
VDDR  (via drill 0.25 pad 0.25)
  Top 0.178: C9.2 37.14,21.51 C8.2 C7.2 36.3,27.37 C10.2 34.57,24.58 L1.2 34.1,24.11 34.1,23.12 31.69,23.12 31.31,23.5 31.31,25.15 30.42,26.04 v30.42,26.54 | IC1.32 18.51,18.44 v18.1,18.04 | IC1.28 18.86,20.07 17.98,20.07 17.85,19.94 16.32,19.94 16.2,20.07 v15.31,20.07 | v7.43,35.43 v10.86,35.43 | v15.56,32.77 v19.12,32.77 | v24.96,34.42 25.85,34.42 v26.48,33.78
  Bottom 0.178: v18.1,18.04 16.2,18.04 15.31,18.42 15.31,18.8 14.8,19.3 | v15.31,20.07 15.31,19.81 14.8,19.3 | 14.8,19.3 10.48,19.3 6.55,23.24 6.55,34.55 v7.43,35.43 | v10.86,35.43 12.9,35.43 v15.56,32.77 | v19.12,32.77 20.77,34.42 v24.96,34.42 | v26.48,33.78 28.14,32.13 28.14,29.97 28.52,29.59 30.68,29.59 30.93,29.34 30.93,27.05 v30.42,26.54
VDDS  (via drill 0.25 pad 0.25)
  Top 0.178: C12.2 32.14,11.68 C14.2 32.1,11.32 30.32,9.54 28.59,9.54 C13.2 | R1.2 25.7,10.5 C11.2 27.3,10.53 C13.2 | C13.2 27.45,13.73 C15.2 BLM.1 27.34,16.26 26.48,16.26 25.6,17.15 v25.6,18.92 25.34,19.18 23.56,19.18 23.5,19.24 IC1.11 | v22.8,23.12 21.53,22.61 21.53,21.88 IC1.19 | IC1.27 18.36,20.44 18.36,20.45 17.85,20.45 17.72,20.32 16.71,20.32 16.58,20.45 15.94,20.45 15.69,20.7 v15.69,21.85
  Bottom 0.178: v15.69,21.85 17.09,22.99 17.72,22.99 17.98,22.73 17.98,22.1 18.48,21.59 19.25,21.59 19.63,21.97 22.29,21.97 v22.8,23.12 22.67,21.21 24.07,19.81 24.71,19.81 v25.6,18.92
X24M_N
  Top 0.178: IC1.30 16.13,19.24 15.82,18.92 14.8,18.92 14.04,19.69 14.04,20.96 | 14.04,20.96 13.66,21.34 Q1.1 | 14.04,20.96 14.8,21.72 14.8,21.94 C3.2
X24M_P
  Top 0.178: C4.2 10.61,20.2 Q1.3 13.29,18.54 16.45,18.54 16.75,18.84 IC1.31
X32K_Q1
  Top 0.178: IC1.5 21.09,16.44 21.15,16.38 22.04,15.88 23.42,15.88 23.9,15.4 | 23.9,15.4 Y1.1 | 23.9,15.4 22.96,15.4 22.42,14.86 22.42,12.43 C5.1
X32K_Q2
  Top 0.178: Y1.2 C6.1 | IC1.6 21.49,16.68 22.17,16.26 24.74,16.26 Y1.2 | 25.6,15.41 Y1.2